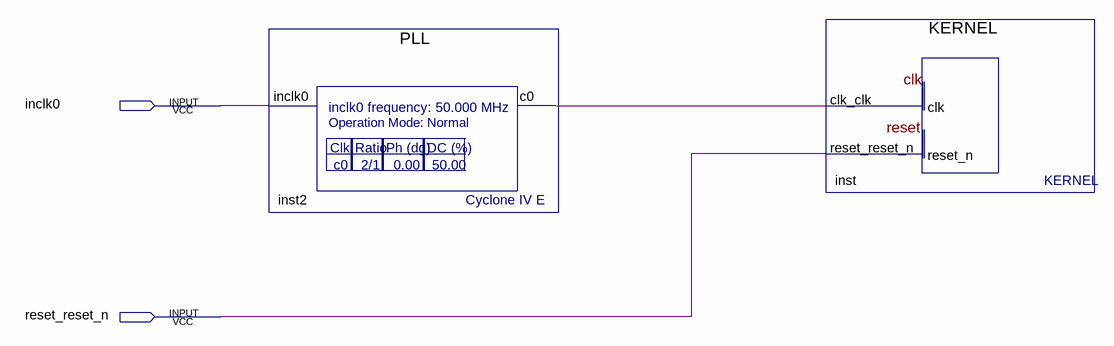
[diagram p0: schematic sheet]
// Quartus schematic HELLO_WORLD.bdf as structural Verilog: 2 symbols, 2 pins
module HELLO_WORLD (
  input  inclk0,
  input  reset_reset_n
);

  wire inst2_c0;

  PLL inst2 (.inclk0(inclk0), .c0(inst2_c0));
  KERNEL inst (.clk_clk(inst2_c0), .reset_reset_n(reset_reset_n));
endmodule
